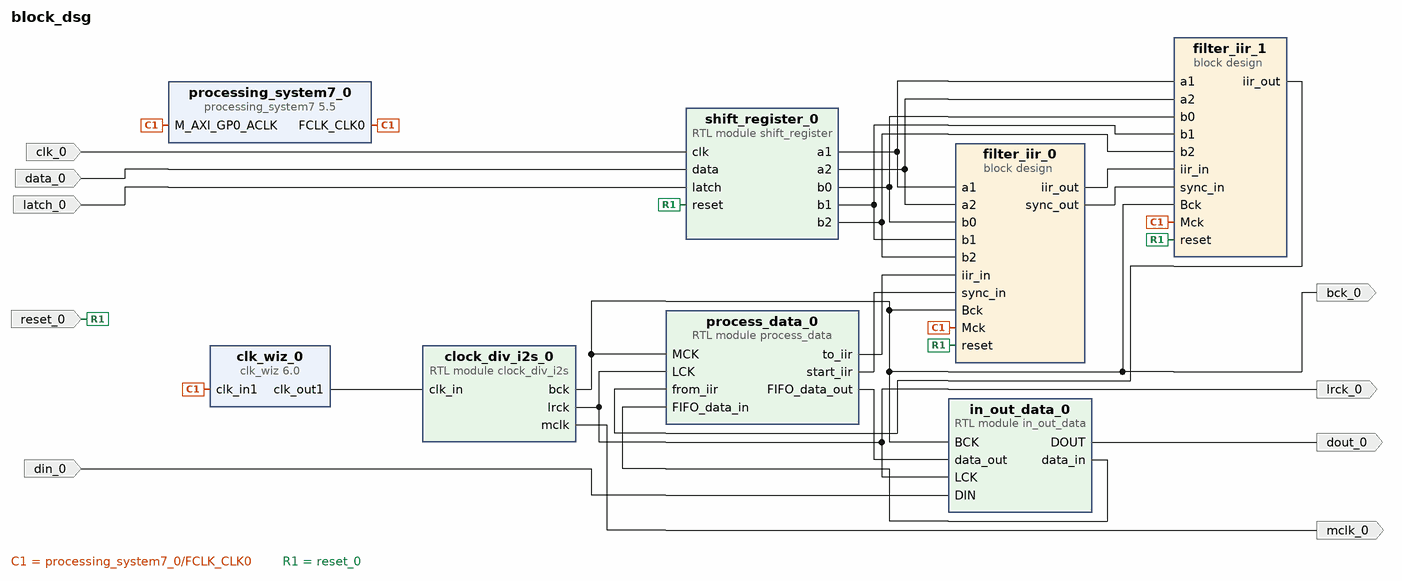
[diagram p0: block diagram of the top level]
# Vivado block design block_dsg, xc7z010clg400-1, Vivado 2024.2
create_bd_design block_dsg

create_bd_port -dir O bck_0
create_bd_port -dir O lrck_0
create_bd_port -dir O mclk_0
create_bd_port -dir I din_0
create_bd_port -dir O dout_0
create_bd_port -dir I -type clk clk_0
create_bd_port -dir I data_0
create_bd_port -dir I latch_0
create_bd_port -dir I -type rst reset_0

create_bd_cell -type module -reference clock_div_i2s clock_div_i2s_0
create_bd_cell -type module -reference in_out_data in_out_data_0
create_bd_cell -type ip -vlnv xilinx.com:ip:clk_wiz:6.0 clk_wiz_0
set_property -dict [list \
  CONFIG.CLKOUT1_DRIVES BUFG \
  CONFIG.CLKOUT1_JITTER 105.610 \
  CONFIG.CLKOUT1_PHASE_ERROR 97.646 \
  CONFIG.CLKOUT1_REQUESTED_OUT_FREQ 300 \
  CONFIG.CLKOUT2_DRIVES BUFG \
  CONFIG.CLKOUT2_JITTER 145.943 \
  CONFIG.CLKOUT2_PHASE_ERROR 94.994 \
  CONFIG.CLKOUT2_REQUESTED_OUT_FREQ 50.000 \
  CONFIG.CLKOUT2_USED false \
  CONFIG.CLKOUT3_DRIVES BUFG \
  CONFIG.CLKOUT4_DRIVES BUFG \
  CONFIG.CLKOUT5_DRIVES BUFG \
  CONFIG.CLKOUT6_DRIVES BUFG \
  CONFIG.CLKOUT7_DRIVES BUFG \
  CONFIG.MMCM_CLKFBOUT_MULT_F 10.125 \
  CONFIG.MMCM_CLKOUT0_DIVIDE_F 3.375 \
  CONFIG.MMCM_CLKOUT1_DIVIDE 1 \
  CONFIG.NUM_OUT_CLKS 1 \
  CONFIG.SECONDARY_SOURCE Single_ended_clock_capable_pin \
  CONFIG.USE_LOCKED false \
  CONFIG.USE_PHASE_ALIGNMENT false \
  CONFIG.USE_RESET false \
] [get_bd_cells clk_wiz_0]
create_bd_cell -type module -reference process_data process_data_0
create_bd_cell -type container -reference filter_iir filter_iir_0
set_property -dict [list \
  CONFIG.ACTIVE_SIM_BD filter_iir.bd \
  CONFIG.ACTIVE_SYNTH_BD filter_iir.bd \
  CONFIG.ENABLE_DFX 0 \
  CONFIG.LIST_SIM_BD filter_iir.bd \
  CONFIG.LIST_SYNTH_BD filter_iir.bd \
  CONFIG.LOCK_PROPAGATE 0 \
] [get_bd_cells filter_iir_0]
create_bd_cell -type module -reference shift_register shift_register_0
create_bd_cell -type container -reference filter_iir filter_iir_1
set_property -dict [list \
  CONFIG.ACTIVE_SIM_BD filter_iir.bd \
  CONFIG.ACTIVE_SYNTH_BD filter_iir.bd \
  CONFIG.ENABLE_DFX 0 \
  CONFIG.LIST_SIM_BD filter_iir.bd \
  CONFIG.LIST_SYNTH_BD filter_iir.bd \
  CONFIG.LOCK_PROPAGATE 0 \
] [get_bd_cells filter_iir_1]
create_bd_cell -type ip -vlnv xilinx.com:ip:processing_system7:5.5 processing_system7_0
set_property -dict [list \
  CONFIG.PCW_APU_PERIPHERAL_FREQMHZ 50 \
  CONFIG.PCW_FPGA0_PERIPHERAL_FREQMHZ 100 \
  CONFIG.PCW_UIPARAM_DDR_FREQ_MHZ 200 \
] [get_bd_cells processing_system7_0]
# 30 more settings of processing_system7_0 are not shown: defaults, MIO pin electricals, DDR timing, and values the tool derives

# ---- connections ----

connect_bd_net -net a1_1 [get_bd_pins shift_register_0/a1] [get_bd_pins filter_iir_0/a1] [get_bd_pins filter_iir_1/a1]
connect_bd_net -net clk_0_1 [get_bd_ports clk_0] [get_bd_pins shift_register_0/clk]
connect_bd_net [get_bd_pins clk_wiz_0/clk_out1] [get_bd_pins clock_div_i2s_0/clk_in]
connect_bd_net [get_bd_pins clock_div_i2s_0/bck] \
  [get_bd_ports bck_0] [get_bd_pins filter_iir_0/Bck] [get_bd_pins filter_iir_1/Bck] [get_bd_pins in_out_data_0/BCK] \
  [get_bd_pins process_data_0/MCK]
connect_bd_net [get_bd_pins clock_div_i2s_0/lrck] [get_bd_ports lrck_0] [get_bd_pins in_out_data_0/LCK] [get_bd_pins process_data_0/LCK]
connect_bd_net [get_bd_pins clock_div_i2s_0/mclk] [get_bd_ports mclk_0]
connect_bd_net -net data_0_1 [get_bd_ports data_0] [get_bd_pins shift_register_0/data]
connect_bd_net -net din_0_1 [get_bd_ports din_0] [get_bd_pins in_out_data_0/DIN]
connect_bd_net [get_bd_pins filter_iir_0/iir_out] [get_bd_pins filter_iir_1/iir_in]
connect_bd_net [get_bd_pins filter_iir_0/sync_out] [get_bd_pins filter_iir_1/sync_in]
connect_bd_net [get_bd_pins filter_iir_1/iir_out] [get_bd_pins process_data_0/from_iir]
connect_bd_net -net iir_in_1 [get_bd_pins process_data_0/to_iir] [get_bd_pins filter_iir_0/iir_in]
connect_bd_net [get_bd_pins in_out_data_0/DOUT] [get_bd_ports dout_0]
connect_bd_net [get_bd_pins in_out_data_0/data_in] [get_bd_pins process_data_0/FIFO_data_in]
connect_bd_net -net latch_0_1 [get_bd_ports latch_0] [get_bd_pins shift_register_0/latch]
connect_bd_net [get_bd_pins process_data_0/FIFO_data_out] [get_bd_pins in_out_data_0/data_out]
connect_bd_net [get_bd_pins process_data_0/start_iir] [get_bd_pins filter_iir_0/sync_in]
connect_bd_net [get_bd_pins processing_system7_0/FCLK_CLK0] \
  [get_bd_pins processing_system7_0/M_AXI_GP0_ACLK] [get_bd_pins clk_wiz_0/clk_in1] [get_bd_pins filter_iir_0/Mck] \
  [get_bd_pins filter_iir_1/Mck]
connect_bd_net -net reset_0_1 [get_bd_ports reset_0] \
  [get_bd_pins filter_iir_0/reset] [get_bd_pins filter_iir_1/reset] [get_bd_pins shift_register_0/reset]
connect_bd_net [get_bd_pins shift_register_0/a2] [get_bd_pins filter_iir_0/a2] [get_bd_pins filter_iir_1/a2]
connect_bd_net [get_bd_pins shift_register_0/b0] [get_bd_pins filter_iir_0/b0] [get_bd_pins filter_iir_1/b0]
connect_bd_net [get_bd_pins shift_register_0/b1] [get_bd_pins filter_iir_0/b1] [get_bd_pins filter_iir_1/b1]
connect_bd_net [get_bd_pins shift_register_0/b2] [get_bd_pins filter_iir_0/b2] [get_bd_pins filter_iir_1/b2]

validate_bd_design
save_bd_design
